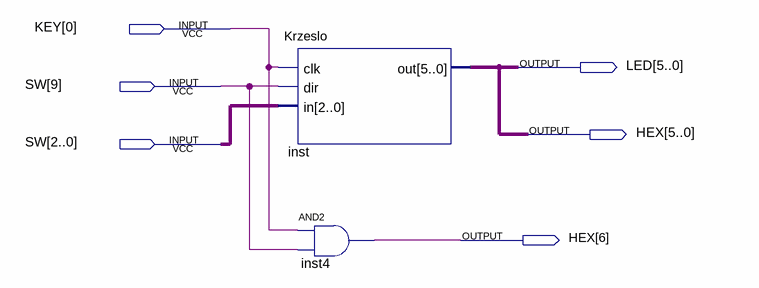
[diagram p0: schematic sheet]
// Quartus schematic mammamia.bdf as structural Verilog: 2 symbols, 6 pins
module mammamia (
  input  [0:0] KEY,
  input  [9:0] SW,
  output [5:0] LED,
  output [6:0] HEX
);

  Krzeslo inst (.clk(KEY[0]), .dir(SW[9]), .in(SW[2:0]), .out(HEX[5:0]));
  and inst4 (HEX[6], KEY[0], SW[9]);

  assign LED = HEX[5:0];
endmodule
